# EAGLE design nfc-attiny-atecc (EAGLE 9.5.2)
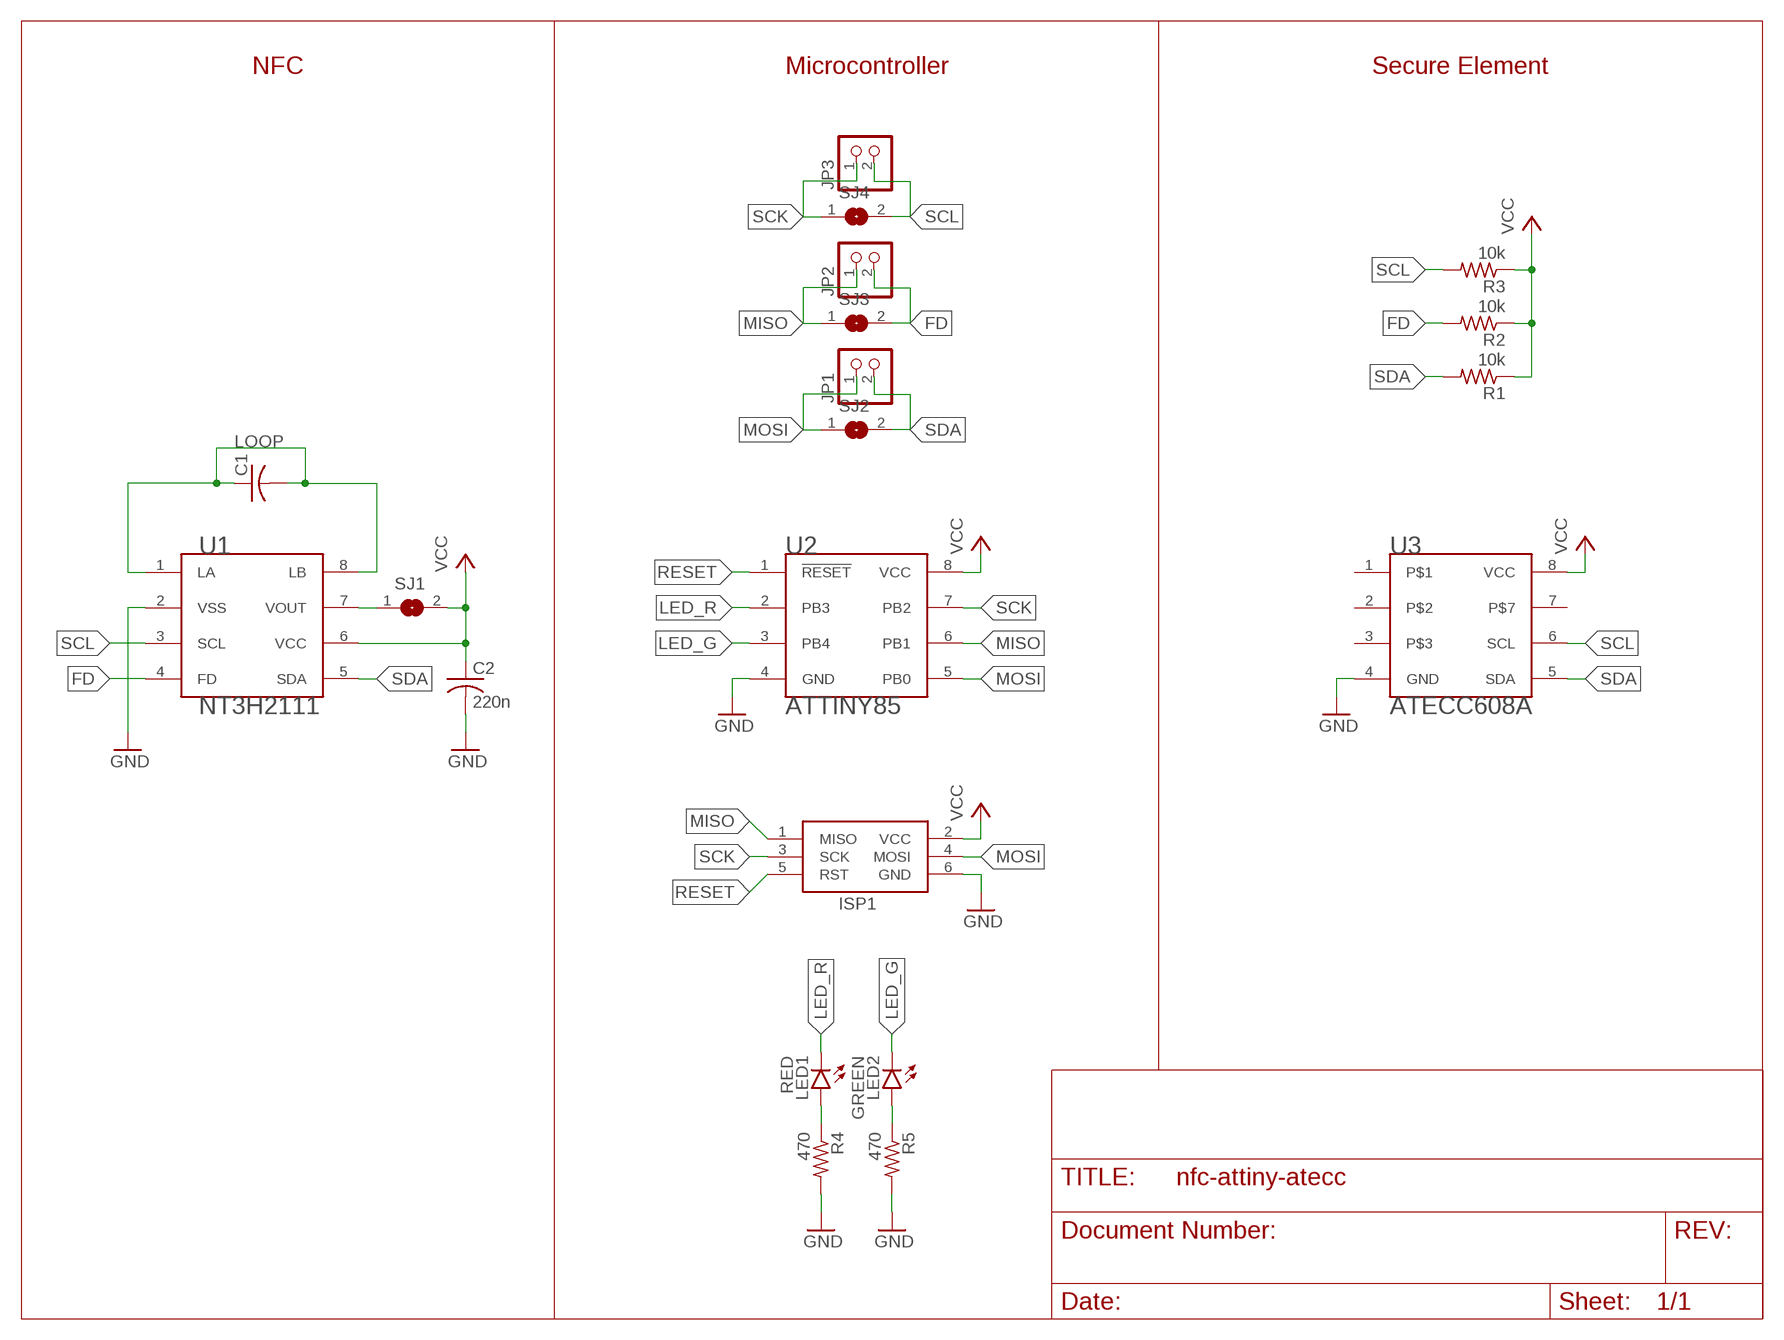
[diagram p0: schematic, sheet 1]

## Parts
C1  C-USC0805  [C0805]
C2  220n  C-USC0805  [C0805]
ISP1  AVRISP-BOX  [AVRISP-BOX]
JP1  PINHD-1X2  [1X02]
JP2  PINHD-1X2  [1X02]
JP3  PINHD-1X2  [1X02]
LED1  RED  LEDCHIP-LED0805  [CHIP-LED0805]
LED2  GREEN  LEDCHIP-LED0805  [CHIP-LED0805]
R1  10k  R-US_R0805  [R0805]
R2  10k  R-US_R0805  [R0805]
R3  10k  R-US_R0805  [R0805]
R4  470  R-US_R0805  [R0805]
R5  470  R-US_R0805  [R0805]
SJ1  SJ  [SJ]
SJ2  SJ  [SJ]
SJ3  SJ  [SJ]
SJ4  SJ  [SJ]
U1  NT3H2111  NT3H2111-SOIC8  [SOIC127P600X175-8N]
U2  ATTINY85  ATTINY85-SOIC8  [SOIC127P797X215-8N]
U3  ATECC608A  ATECC608A-SOIC8  [SOIC127P600X175-8N]

## Nets
FD: JP2.2 R2.2 SJ3.2 U1.4(FD)
GND: C2.2 ISP1.6(GND) R4.2 R5.2 U1.2(VSS) U2.4(GND) U3.4(GND)
LED_G: LED2.C U2.3(PB4)
LED_R: LED1.C U2.2(PB3)
LOOP: C1.1 C1.2 U1.1(LA) U1.8(LB)
MISO: ISP1.1(MISO) JP2.1 SJ3.1 U2.6(PB1)
MOSI: ISP1.4(MOSI) JP1.1 SJ2.1 U2.5(PB0)
N$1 [pwr]: SJ1.1 U1.7(VOUT)
N$4: LED1.A R4.1
N$5: LED2.A R5.1
RESET: ISP1.5(RST) U2.1(!RESET)
SCK: ISP1.3(SCK) JP3.1 SJ4.1 U2.7(PB2)
SCL: JP3.2 R3.2 SJ4.2 U1.3(SCL) U3.6(SCL)
SDA: JP1.2 R1.2 SJ2.2 U1.5(SDA) U3.5(SDA)
VCC [pwr]: C2.1 ISP1.2(VCC) R1.1 R2.1 R3.1 SJ1.2 U1.6(VCC) U2.8(VCC) U3.8(VCC)
Unconnected: U3.1 U3.2 U3.3 U3.7

## Notes on the sheet
- NFC | Microcontroller | Secure Element

## Library data of the parts
C1 C2 = rcl:C-US: CAPACITOR, American symbol; SPICEPREFIX: C
ISP1 = adafruit:AVRISP: AVR ISP HEADER Standard 6 pin header for AVR programming
JP1-JP3 = pinhead:PINHD-1X2: PIN HEADER
LED1 LED2 = led:LED: LED OSRAM: - CHIPLED LG R971, LG N971, LY N971, LG Q971, LY Q971, LO R971, LY R971 LH N974, LH R974 LS Q976, LO Q976, LY Q976 LO Q996 - Hyper CHIPLED LW Q18S LB Q993, LB Q99A, LB R99A - SideLED LS A670, LO A670, LY A670, LG A670, LP A670 LB A673, LV A673, LT A673, LW A673 LH A674 LY A675 LS A676, LA A676, LO A676, LY A676, LW A676 LS A679, LY A679, LG A679 - Hyper Micro SIDELED® LS Y876, LA Y876, LO Y876, LY Y876 LT Y87S - SmartLED LW L88C, LW L88S LB L89C, LB L89S, LG L890 LS L89K, LO L89K, LY L89K LS L896, LA L896, LO L896, LY L896 - TOPLED LS T670, LO T670, LY T670, LG T670, LP T670 LSG T670, LSP T670, LSY T670, LOP T670, LYG T670 LG T671, LOG T671, LSG T671 LB T673, LV T673, LT T673, LW T673 LH T674 LS T676, LA T676, LO T676, LY T676, LB T676, LH T676, LSB T676, LW T676 LB T67C, LV T67C, LT T67C, LS T67K, LO T67K, LY T67K, LW E67C LS E67B, LA E67B, LO E67B, LY E67B, LB E67C, LV E67C, LT E67C LW T67C LS T679, LY T679, LG T679 LS T770, LO T770, LY T770, LG T770, LP T770 LB T773, LV T773, LT T773, LW T773 LH T774 LS E675, LA E675, LY E675, LS T675 LS T776, LA T776, LO T776, LY T776, LB T776 LHGB T686 LT T68C, LB T68C - Hyper Mini TOPLED® LB M676 - Mini TOPLED Santana® LG M470 LS M47K, LO M47K, LY M47K Source: http://www.osram.convergy.de LUXEON: - LUMILED® LXK2-PW12-R00, LXK2-PW12-S00, LXK2-PW14-U00, LXK2-PW14-V00 LXK2-PM12-R00, LXK2-PM12-S00, LXK2-PM14-U00 LXK2-PE12-Q00, LXK2-PE12-R00, LXK2-PE12-S00, LXK2-PE14-T00, LXK2-PE14-U00 LXK2-PB12-K00, LXK2-PB12-L00, LXK2-PB12-M00, LXK2-PB14-N00, LXK2-PB14-P00, LXK2-PB14-Q00 LXK2-PR12-L00, LXK2-PR12-M00, LXK2-PR14-Q00, LXK2-PR14-R00 LXK2-PD12-Q00, LXK2-PD12-R00, LXK2-PD12-S00 LXK2-PH12-R00, LXK2-PH12-S00 LXK2-PL12-P00, LXK2-PL12-Q00, LXK2-PL12-R00 Source: www.luxeon.com KINGBRIGHT: KA-3528ASYC Source: www.kingbright.com
R1-R5 = rcl:R-US_: RESISTOR, American symbol; SPICEPREFIX: R
SJ1-SJ4 = jumper:SJ: SMD solder JUMPER
U1 = nfc_attiny_atecc:NT3H2111; MPN: NT3H2111W0FT1X
U2 = nfc_attiny_atecc:ATTINY85; MPN: ATTINY85V-10SU
U3 = nfc_attiny_atecc:ATECC608A

## Net classes
1 pwr: width 0.305 mm

## Board
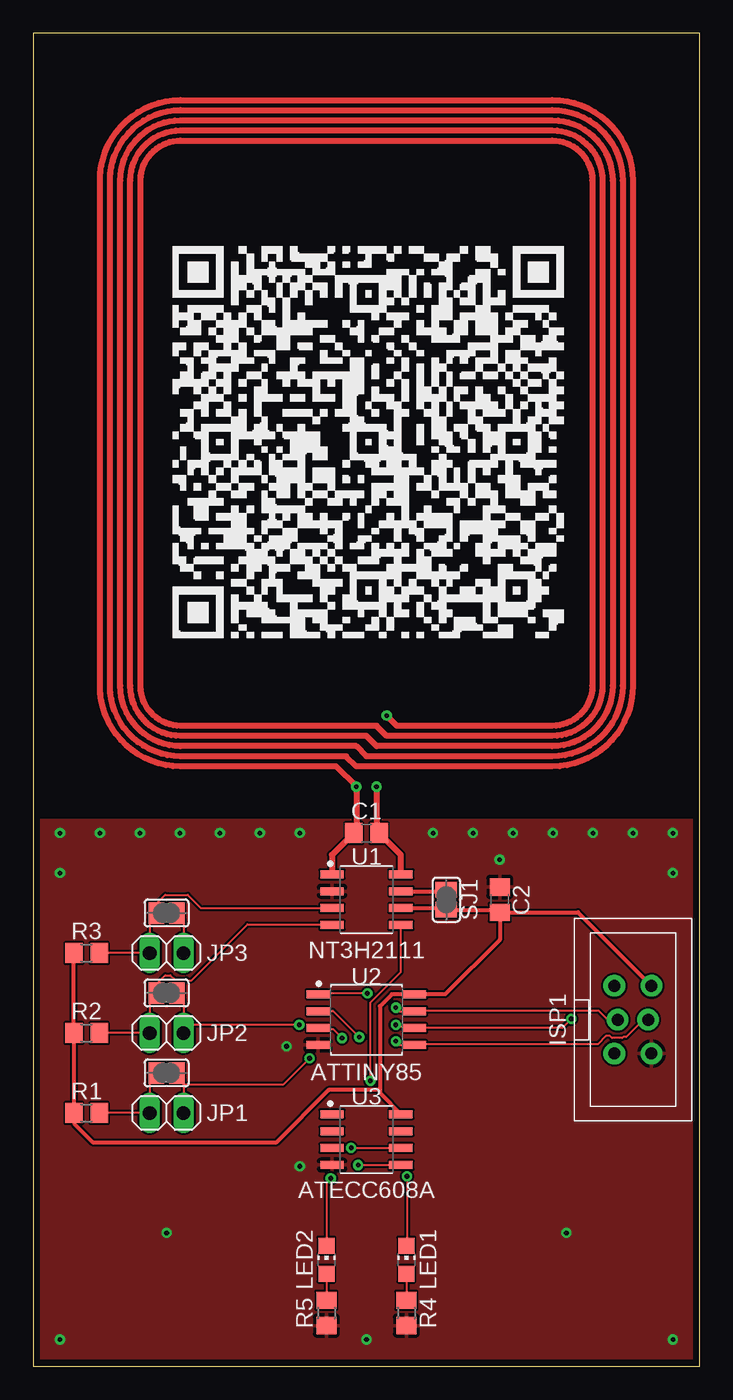
[diagram p1: board, top side]
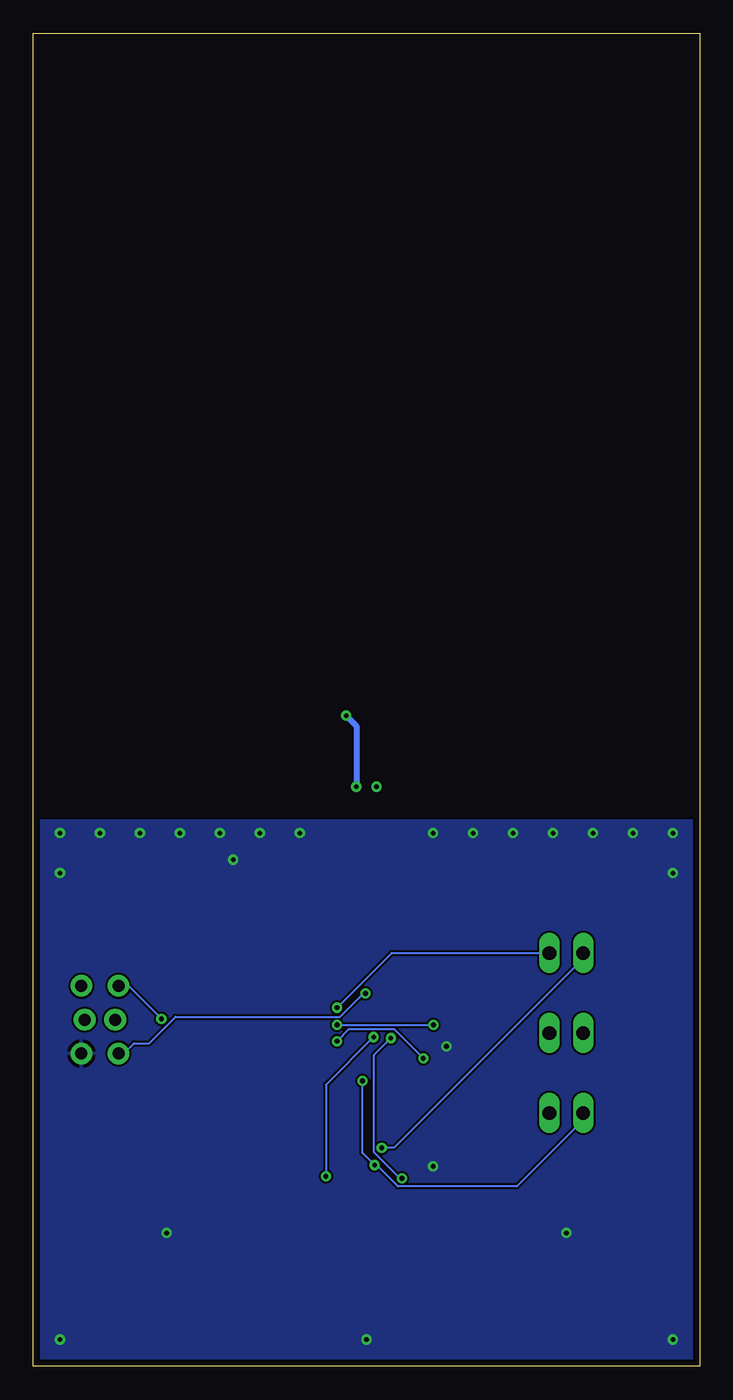
[diagram p2: board, bottom side, seen from below]

Size 50 x 100 mm. Coordinates in mm from the lower left corner, seen from the top.
Outline: 0,0 50,0 50,100 0,100 0,0
Copper layers (1*16): Top 0.035mm / dielectric 1.5mm / Bottom 0.035mm
Design rules "default *": minimum track width 6mil, minimum drill 0.35mm, track to track 6mil, track to pad 6mil, pad to pad 6mil, via to via 6mil, smd to smd 6mil, copper to edge 20mil, drill to drill 6mil, minimum pad ring 10mil, minimum via ring 8mil, stop-mask expansion 4mil, vias tented up to drill 20mil, thermal gap 10mil

### Footprints (pad centres in the part's own frame; a part is rotated, then mirrored left to right if it is on the bottom)
C0805 = smd 1.3 x 1.5: 1 -0.95,0; 2 0.95,0
AVRISP-BOX = drill 0.9 pad 1.626: 1 -1.397,2.54; 2 1.397,2.54; 3 -1.143,0; 4 1.143,0; 5 -1.397,-2.54; 6 1.397,-2.54
1X02 = drill 1.016 long: 1 -1.27,0; 2 1.27,0
CHIP-LED0805 = smd 1.2 x 1.2: A 0,-1.05; C 0,1.05
R0805 = smd 1.3 x 1.5: 1 -0.95,0; 2 0.95,0
SJ = smd 1.168 x 1.6: 1 -0.762,0; 2 0.762,0
SOIC127P600X175-8N = smd 1.746 x 0.597: 1 -2.585,1.905; 2 -2.585,0.635; 3 -2.585,-0.635; 4 -2.585,-1.905; 5 2.585,-1.905; 6 2.585,-0.635; 7 2.585,0.635; 8 2.585,1.905
SOIC127P797X215-8N = smd 1.707 x 0.597: 1 -3.627,1.905; 2 -3.627,0.635; 3 -3.627,-0.635; 4 -3.627,-1.905; 5 3.627,-1.905; 6 3.627,-0.635; 7 3.627,0.635; 8 3.627,1.905

### Placement (x,y rotation side)
C1  25,40 0 top
C2  35,35 90 top
ISP1  45,26 0 top
JP1  10,19 180 top
JP2  10,25 180 top
JP3  10,31 180 top
LED1  28,8 0 top
LED2  22,8 0 top
R1  4,19 0 top
R2  4,25 0 top
R3  4,31 0 top
R4  28,4 270 top
R5  22,4 270 top
SJ1  31,35 270 top
SJ2  10,22 180 top
SJ3  10,28 180 top
SJ4  10,34 180 top
U1  25,35 0 top
U2  25,26 0 top
U3  25,17 0 top

### Tracks (layer width: path | path; a pad name or v marks a point on that pad's centre or on a via)
FD
  Top 0.152: R2.2 JP2.2 8.73,27.49 SJ3.2 9.3,28.04 9.3,28.73 9.91,29.34 10.29,29.34 10.59,29.03 11.51,29.03 11.58,28.96 11.89,28.96 16.08,33.15 22.4,33.15 U1.4
GND  (via drill 0.35)
  other vias: 48,40 45,40 42,40 39,40 36,40 33,40 30,40 2,40 5,40 8,40 11,40 14,40 17,40 20,40 48,37 2,37 2,2 48,2 25,2 10,10 40,10 35,38 19,24 20,15
  pour Top: 41,41 -1,41 -1,-1 51,-1 51,41
  pour Bottom: 39,41 -1,41 -1,-1 51,-1 51,41
LED_G  (via drill 0.35)
  Top 0.152: v22.33,14.1 22.02,13.79 22.02,9.07 LED2.C | v23.16,24.61 22.48,25.3 21.41,25.3 U2.3
  Bottom 0.152: v22.33,14.1 22.48,14.1 24.46,16.08 24.46,23.32 v23.16,24.61
LED_R  (via drill 0.35)
  Top 0.152: v28.04,14.25 28.04,9.07 LED1.C | v24.46,24.69 22.48,26.67 21.41,26.67 U2.2
  Bottom 0.152: v28.04,14.25 28.04,21.11 v24.46,24.69
LOOP  (via drill 0.35)
  Top 0.457: v26.52,48.81 27.29,48.05 38.95,48.05 arc90 41.95,51.05 41.95,88.95 arc90 38.95,91.95 11.05,91.95 arc90 8.05,88.95 8.05,51.05 arc90 11.05,48.05 25.76,48.05 26.52,47.29 38.95,47.29 arc90 42.71,51.05 42.71,88.95 arc90 38.95,92.71 11.05,92.71 arc90 7.29,88.95 7.29,51.05 arc90 11.05,47.29 25,47.29 25.76,46.52 38.95,46.52 arc90 43.48,51.05 43.48,88.95 arc90 38.95,93.48 11.05,93.48 arc90 6.52,88.95 6.52,51.05 arc90 11.05,46.52 24.24,46.52 25,45.76 38.95,45.76 arc90 44.24,51.05 44.24,88.95 arc90 38.95,94.24 11.05,94.24 arc90 5.76,88.95 5.76,51.05 arc90 11.05,45.76 23.48,45.76 24.24,45 38.95,45 arc90 45,51.05 45,88.95 arc90 38.95,95 11.05,95 arc90 5,88.95 5,51.05 arc90 11.05,45 22.71,45 v24.24,43.48 24.24,40.19 C1.1 22.41,38.37 U1.1 | v25.76,43.48 25.76,40.19 C1.2 27.59,38.37 U1.8
  Bottom 0.457: v26.52,48.81 25.76,48.05 v25.76,43.48
MISO  (via drill 0.35)
  Top 0.152: SJ3.1 11.27,27.49 JP2.1 11.28,25.6 v19.96,25.6 | v40.39,26.06 39.7,25.38 28.65,25.38 U2.6 28.65,25.45 27.36,25.45 v27.2,25.6
  Bottom 0.152: v40.39,26.06 42.82,28.5 43.59,28.5 ISP1.1 | v27.2,25.6 v19.96,25.6
MOSI  (via drill 0.35)
  Top 0.152: SJ2.1 11.27,21.49 11.27,21.11 | 11.27,21.11 JP1.1 | ISP1.4 46.1,25.98 45.8,25.98 44.5,24.69 44.27,24.69 44.2,24.61 43.43,24.61 43.28,24.77 42.98,24.77 42.37,24.16 28.65,24.16 U2.5 28.57,24.08 27.51,24.08 v27.2,24.38 | 11.27,21.11 18.75,21.11 v20.73,23.09
  Bottom 0.152: v20.73,23.09 22.94,25.3 26.29,25.3 v27.2,24.38
N$1
  Top 0.305: U1.7 30.87,35.63 SJ1.1
N$4
  Top 0.152: LED1.A R4.1
N$5
  Top 0.152: LED2.A R5.1
RESET  (via drill 0.35)
  Top 0.152: v25.07,27.96 21.41,27.96 U2.1
  Bottom 0.152: v25.07,27.96 25.22,27.96 26.98,26.21 39.32,26.21 41.3,24.23 42.44,24.23 43.2,23.47 43.59,23.47 ISP1.5
SCK  (via drill 0.35)
  Top 0.152: SJ4.1 11.27,33.49 JP3.1 | ISP1.3 43.81,26.06 43.05,26.06 42.44,26.67 28.65,26.67 U2.7 28.57,26.59 27.51,26.59 v27.2,26.9
  Bottom 0.152: v27.2,26.9 23.09,31.01 11.28,31.01 JP3.1
SCL  (via drill 0.35)
  Top 0.152: R3.2 JP3.2 8.73,33.49 SJ4.2 9.3,34.06 9.3,34.75 9.91,35.36 11.58,35.36 12.57,34.37 22.4,34.37 U1.3 | v23.85,16.38 27.58,16.38 U3.6
  Bottom 0.152: v23.85,16.38 22.94,16.38 8.76,30.56 8.76,30.94 JP3.2
SDA  (via drill 0.35)
  Top 0.152: SJ2.2 8.73,21.49 JP1.2 R1.2 | v24.38,15.09 27.58,15.09 U3.5 | v25.3,21.41 25.3,27.28 27.58,29.57 27.58,33.07 U1.5
  Bottom 0.152: JP1.2 8.76,18.97 8.76,18.44 13.72,13.49 22.63,13.49 24.23,15.09 v24.38,15.09 25.3,16 v25.3,21.41
VCC
  Top 0.305: U1.6 30.87,34.37 SJ1.2 34.81,34.24 C2.1 | C2.1 40.89,34.05 ISP1.2 | C2.1 35,32 30.91,27.91 U2.8 26.91,27.91 26,27 26,20.73 | 26,20.73 26,20.49 U3.8 | R3.1 3.05,30.94 3.05,25.15 R2.1 3.05,19.05 R1.1 3.12,18.9 3.12,18.14 4.5,16.76 18.21,16.76 22.17,20.73 26,20.73